# EasyEDA Pro project ProPrj_Micro-Profilometer_2025-09-25.epro, board PCB1
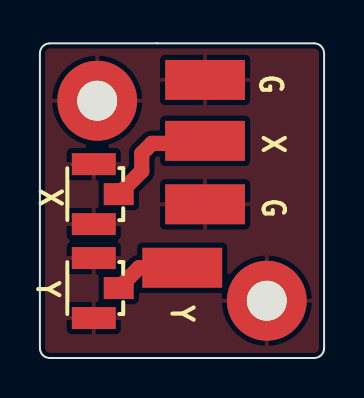
[diagram p5: board, top side]
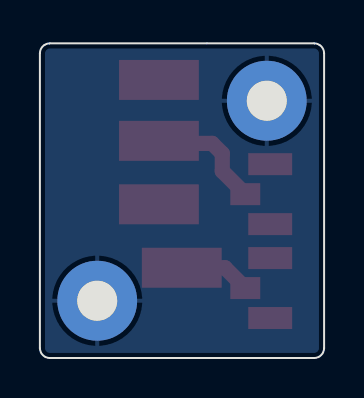
[diagram p6: board, bottom side, seen from below]

Outline 14.25 x 15.75 mm; copper layers: Top Layer, Bottom Layer. Coordinates in mm from the lower left corner of the outline.
Outline path: 0,15.25 0,0.5 arc(0.15,0.15) 0.5,0 13.75,0 arc(14.1,0.15) 14.25,0.5 14.25,15.25 arc(14.1,15.6) 13.75,15.75 0.5,15.75 arc(0.15,15.6) 0,15.25
Stack: Top Layer 0.035mm / Dielectric1 1.51mm FR4 er 4.5 / Bottom Layer 0.035mm

## Design rules (mm)
template: JLCPCB Capability(Two Layers Board)
spacing copperThickness1oz (default): track to track 0.102, other pairs 0.152 to 0.3
spacing copperThickness2oz: track to track 0.203, other pairs 0.152 to 0.3
track width copperThickness1oz (default): min 0.127, default 0.254, max 2.54
track width copperThickness2oz: min 0.203, default 0.254, max 2.54
differential pair differentialPair (default): width min 0.127, default 0.254, max 2.54; gap min 0.152, default 0.152
via viaSize (default): diameter min 0.5, default 0.61, max 10; hole min 0.3, default 0.305, max 6.3

## Placement (name value [footprint] x y rotation side)
JP1  U.FL-R-SMT-1(10)  [ANT-SMD_UFL-R-SMT-1-10]  3.33 8.2 180 top
JP2  U.FL-R-SMT-1(10)  [ANT-SMD_UFL-R-SMT-1-10]  3.33 3.5 180 top
NOREF  -  [Pad_e52]  8.28 10.87 90 top
NOREF#2  -  [Pad_e49]  11.37 2.87 0 top
NOREF#3  -  [Pad_e46]  2.87 12.88 0 top
NOREF#4  -  [Pad_e50]  8.28 13.92 90 top
NOREF#5  -  [Pad_e53]  8.28 7.69 90 top
NOREF#6  -  [Pad_e54]  7.14 4.52 90 top

## Footprints (pads in the part's own frame, mm; a bottom-side part is the same pattern mirrored in y, then rotated)
ANT-SMD_UFL-R-SMT-1-10
  rect 2.2x1.1 smd: 1(0.625,1.5) 3(0.625,-1.5)
  rect 1.5x1.1 smd: 2(-0.625,0.001)
Pad_e46
  round 4 hole 2: 1(0,0)
Pad_e49
  round 4 hole 2: 2(0,0)
Pad_e50
  rect 2x4 smd: 1(0,0)
Pad_e52
  rect 2x4 smd: 1(0,0)
Pad_e53
  rect 2x4 smd: 1(0,0)
Pad_e54
  rect 2x4 smd: 1(0,0)

## Nets
GND: JP1.1 JP1.3 JP2.1 JP2.3 NOREF#2.2 NOREF#3.1 NOREF#4.1 NOREF#5.1
X_AXIS: JP1.2 NOREF.1
Y_AXIS: JP2.2 NOREF#6.1

## Routing (per net, layer and track width the routed paths; a pad name or vN(x,y) marks a point on that pad's centre or on a via; arc(x,y) is an arc through that point)
X_AXIS: length 5.9
  Top Layer w0.762: 8.28,10.74 5.61,10.74 5.1,10.23 5.1,9.35 JP1.2
Y_AXIS: length 3.6
  Top Layer w0.762: JP2.2 4.97,4.52 NOREF#6.1

## Copper pours and planes (outline as drawn; the poured copper is in the pictures)
GND on Top Layer: -1.37,16.96 15.52,16.96 15.52,-1.2 -1.37,-1.2
GND on Bottom Layer: -0.87,16.96 15.9,16.96 15.9,-1.58 -0.87,-1.58

## Text on the board
Top Silkscreen Layer: Y | X | G
